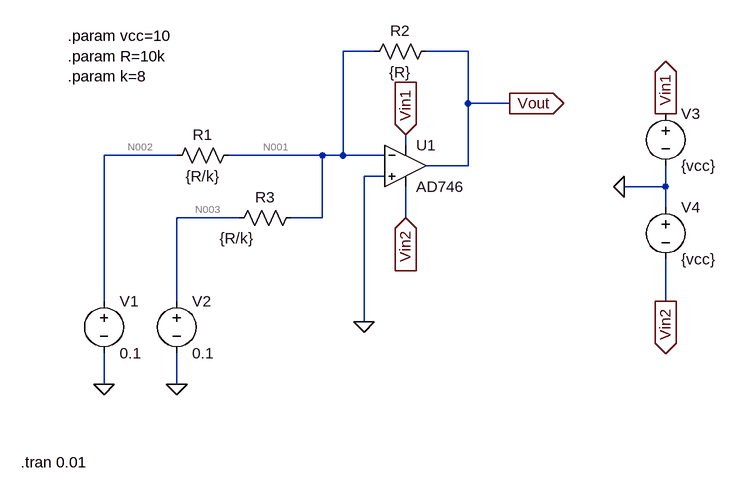
[diagram p0: schematic lab2_1.asc]
lab2_1.asc, the LTspice schematic file:
Version 4
SHEET 1 1016 680
WIRE 336 -64 288 -64
WIRE 480 -64 416 -64
WIRE 480 16 480 -64
WIRE 544 16 480 16
WIRE 384 80 384 64
WIRE 32 96 -80 96
WIRE 256 96 112 96
WIRE 288 96 288 -64
WIRE 288 96 256 96
WIRE 352 96 288 96
WIRE 480 112 480 16
WIRE 480 112 416 112
WIRE 352 128 320 128
WIRE 784 144 784 112
WIRE 784 144 720 144
WIRE 784 176 784 144
WIRE 128 192 32 192
WIRE 256 192 256 96
WIRE 256 192 208 192
WIRE 384 192 384 144
WIRE -80 320 -80 96
WIRE 32 320 32 192
WIRE 784 320 784 256
WIRE 320 352 320 128
WIRE -80 448 -80 400
WIRE 32 448 32 400
FLAG 320 352 0
FLAG 32 448 0
FLAG -80 448 0
FLAG 544 16 Vout
IOPIN 544 16 Out
FLAG 784 32 Vin1
IOPIN 784 32 Out
FLAG 720 144 0
FLAG 784 320 Vin2
IOPIN 784 320 Out
FLAG 384 64 Vin1
IOPIN 384 64 In
FLAG 384 192 Vin2
IOPIN 384 192 In
SYMBOL res 128 80 R90
WINDOW 0 0 56 VBottom 2
WINDOW 3 32 56 VTop 2
SYMATTR InstName R1
SYMATTR Value {R/k}
SYMBOL res 432 -80 R90
WINDOW 0 0 56 VBottom 2
WINDOW 3 32 56 VTop 2
SYMATTR InstName R2
SYMATTR Value {R}
SYMBOL res 224 176 R90
WINDOW 0 0 56 VBottom 2
WINDOW 3 32 100 VTop 2
SYMATTR InstName R3
SYMATTR Value {R/k}
SYMBOL voltage -80 304 R0
WINDOW 123 0 0 Left 0
WINDOW 39 0 0 Left 0
SYMATTR InstName V1
SYMATTR Value 0.1
SYMBOL voltage 32 304 R0
WINDOW 123 0 0 Left 0
WINDOW 39 0 0 Left 0
SYMATTR InstName V2
SYMATTR Value 0.1
SYMBOL Opamps\\AD746 384 48 R0
SYMATTR InstName U1
SYMBOL voltage 784 16 R0
WINDOW 123 0 0 Left 0
WINDOW 39 0 0 Left 0
SYMATTR InstName V3
SYMATTR Value {vcc}
SYMBOL voltage 784 160 R0
WINDOW 123 0 0 Left 0
WINDOW 39 0 0 Left 0
SYMATTR InstName V4
SYMATTR Value {vcc}
TEXT -208 568 Left 2 !.tran 0.01
TEXT -136 -88 Left 2 !.param vcc=10\n.param R=10k\n.param k=8

The netlist it stands for:
* lab2_1.asc
R1 N001 N002 {R/k}
R2 Vout N001 {R}
R3 N001 N003 {R/k}
V1 N002 0 0.1
V2 N003 0 0.1
XU1 0 N001 Vin1 Vin2 Vout AD746  ; pins In+ In- V+ V- OUT
V3 Vin1 0 {vcc}
V4 0 Vin2 {vcc}
.tran 0.01
.param vcc=10
.param R=10k
.param k=8
.backanno
.end

* Results of the author's LTspice run, read from the files saved beside the schematic
* Operating Point, zero values left out:
*   V(n001) = 4.56 µV
*   V(n002) = 100 mV
*   V(vout) = -1.6 V
*   V(n003) = 100 mV
*   V(vin1) = 10 V
*   V(vin2) = -10 V
*   I(R3) = -80 µA
*   I(R2) = -160 µA
*   I(R1) = -80 µA
*   I(V4) = -4.794 mA
*   I(V3) = -4.634 mA
*   I(V2) = -80 µA
*   I(V1) = -80 µA
*   Ix(u1:1) = 110 pA
*   Ix(u1:2) = 110 pA
*   Ix(u1:3) = 4.634 mA
*   Ix(u1:4) = -4.794 mA
*   Ix(u1:5) = 160 µA